# Altium schematic sheet drivers.SchDoc
size A
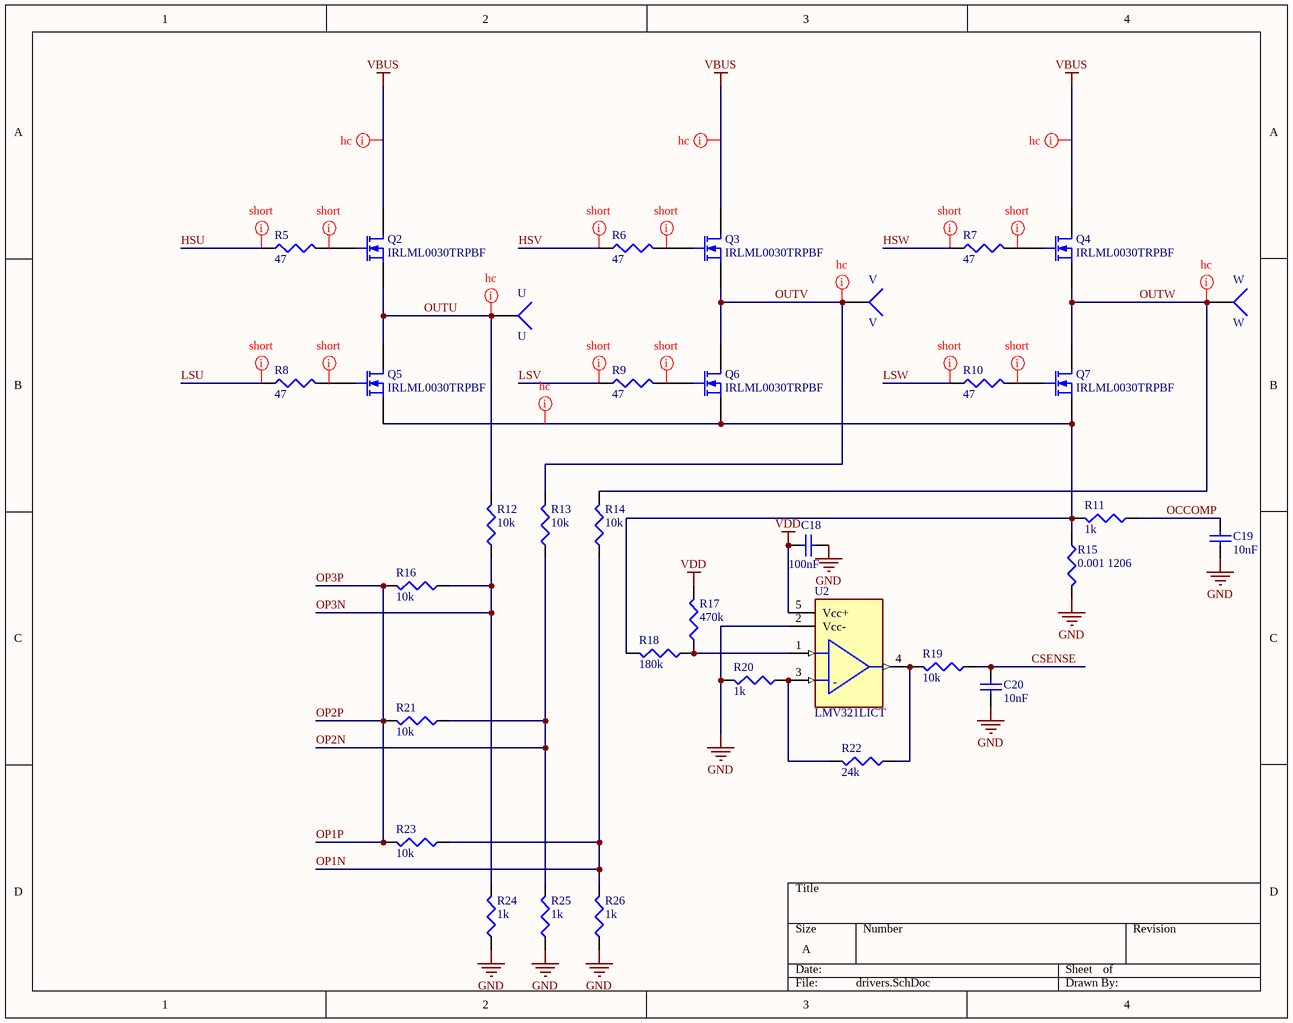
[diagram p0: drivers.SchDoc]

## Parts
C18  100nF  [MY_0402]
C19  10nF  [MY_0402]
C20  10nF  [MY_0402]
Q2  IRLML0030TRPBF  [Micro3]
Q3  IRLML0030TRPBF  [Micro3]
Q4  IRLML0030TRPBF  [Micro3]
Q5  IRLML0030TRPBF  [Micro3]
Q6  IRLML0030TRPBF  [Micro3]
Q7  IRLML0030TRPBF  [Micro3]
R5  47  [MY_0402]
R6  47  [MY_0402]
R7  47  [MY_0402]
R8  47  [MY_0402]
R9  47  [MY_0402]
R10  47  [MY_0402]
R11  1k  [MY_0402]
R12  10k  [MY_0402]
R13  10k  [MY_0402]
R14  10k  [MY_0402]
R15  0.001 1206  [MY_1206]
R16  10k  [MY_0402]
R17  470k  [MY_0402]
R18  180k  [MY_0402]
R19  10k  [MY_0402]
R20  1k  [MY_0402]
R21  10k  [MY_0402]
R22  24k  [MY_0402]
R23  10k  [MY_0402]
R24  1k  [MY_0402]
R25  1k  [MY_0402]
R26  1k  [MY_0402]
U  U  [solder_pin_small]
U2  LMV321LICT  [FP-SOT323-5-IPC_C]
V  V  [solder_pin_small]
W  W  [solder_pin_small]

## Nets
GND: C18.2 C19.1 C20.1 R15.2 R20.2 R24.1 R25.1 R26.1 U2.2(Vcc-)
VBUS: Q2.D Q3.D Q4.D
VDD: C18.1 R17.2 U2.5(Vcc+)
CSENSE: C20.2 R19.1
HSU: R5.1
HSV: R6.1
HSW: R7.1
LSU: R8.1
LSV: R9.1
LSW: R10.1
OCCOMP: C19.2 R11.1
OP1N: R14.1 R23.1 R26.2
OP1P: R16.2 R21.2 R23.2  [also labelled OP2P, OP3P]
OP2N: R13.1 R21.1 R25.2
OP3N: R12.1 R16.1 R24.2
OUTU: Q2.S Q5.D R12.2 U.1
OUTV: Q3.S Q6.D R13.2 V.1
OUTW: Q4.S Q7.D R14.2 W.1
NetQ2_G: Q2.G R5.2
NetQ3_G: Q3.G R6.2
NetQ4_G: Q4.G R7.2
NetQ5_G: Q5.G R8.2
NetQ5_S: Q5.S Q6.S Q7.S R11.2 R15.1 R18.2
NetQ6_G: Q6.G R9.2
NetQ7_G: Q7.G R10.2
NetR17_1: R17.1 R18.1 U2.1(In+)
NetR19_2: R19.2 R22.1 U2.4(Out)
NetR20_1: R20.1 R22.2 U2.3(In-)

## Layout directives
net class short: HSU, HSV, HSW, LSU, LSV, LSW, NetQ2_G, NetQ3_G, NetQ4_G, NetQ5_G, NetQ6_G, NetQ7_G
net class hc: NetQ5_S, OUTU, OUTV, OUTW, VBUS

## Notes on the sheet
- (in symbol CMP-12131-000006-1) -

## Library data of the parts
C18-C20 = Cap: Capacitor; Published: 8-Jun-2000; LatestRevisionDate: 17-Jul-2002; LatestRevisionNote: Re-released for DXP Platform.; PackageReference: RAD-0.3; Publisher: Altium Limited; PackageDescription: Radial Cap, Thru-Hole; 2 Leads; 0.3 in Pin Spacing
  C18: Value: 100nF
  C19 C20: Value: 10nF
Q2-Q7 = MOSFET-N: N-Channel MOSFET; Published: 8-Jun-2000; LatestRevisionDate: 17-Jul-2002; LatestRevisionNote: Re-released for DXP Platform.; PackageVersion: 1995/1996; PackageReference: E3; Publisher: Altium Limited; PackageDescription: TO, Flat Index; 3 In-Line, Axial Leads; Body Dia. 4.6mm; Lead Dia. 0.5 mm (max)
R5-R26 = Res3: Resistor; Value: 50; Published: 8-Jun-2000; LatestRevisionDate: 29-May-2009; LatestRevisionNote: IPC-7351 Footprint Added.; PackageReference: J1-0603; Publisher: Altium Limited; PackageDescription: Chip Resistor
U V W = Socket: LatestRevisionDate: 17-Jul-2002; LatestRevisionNote: Re-released for DXP Platform.; Publisher: Altium Limited
U2 = CMP-12131-000006-1: IC OPAMP GP 1 CIRCUIT SC70-5; Manufacturer: STMicroelectronics; Input Bias Current: 0.027uA; Min Supply Voltage: 2.7V; Output Current Per Channel: 43mA; Voltage Gain: 100dB; Max Junction Temp: +150°C; Nominal Supply Current: 120-130uA; Number Of Channels: 1; Input Offset Voltage: 1mV; Gain Bandwidth: 1.3MHz; Max Supply Voltage: 5.5V; ComponentLink2URL: https://www.st.com/resource/en/datasheet/lmv321l.pdf; Digikey Description: IC OPAMP GP 1 CIRCUIT SC70-5; ComponentLink2Description: Datasheet; Package: SOT323-5; Temperature Range High: +125°C; Automotive: No; Ambient Temperature Range Low: -40°C; Category: IC; Device Class L2: Linear ICs; Mouser Description: Operational Amplifiers - Op Amps 1.3MHz LP Gen Op-Amp 250uA at 5V 7mV 25c; Octopart: https://octopart.com/lmv321lict-stmicroelectronics-23014003; Height: 1.1mm; Ambient Temperature Range High: +125°C; Ipc Land Pattern Name: SOT65P210X95-5; Device Class L1: Integrated Circuits (ICs); Temperature: -40°C to +125°C; Manufacturer Part Number: LMV321LICT; Device Class L3: Amplifiers - Op Amps; RoHS: TRUE; Temperature Range Low: -40°C; Lead Free: Yes